# Altium project PROC154E3_SCH.PrjPcb (part 57 of 60)

## Sheet 61. SERDES CLOCK GENERATORS.SchDoc: SERDES CLOCK GENERATORS
size 513 x 386 mm; Project: PROC154E2(001)_SK_AM69; Issue: 1.0; RevCode: E3; Page Create Date: March  8, 1995; Variant Name: Core Design; Schematic Page Number: 61; Page Number: 61; Page Size: C; Comment: MISTRAL_TITLEBLK_CSIZE_1; Page Count: 62; Schematic Page Count: 62; Name: PROC154E2 001 SK AM69; DsnPath: C:\Users\danie\Downloads\sprr466c\PROC154E3_RP\PROC154E3_SCH.DSN; SchematicName: SCHEMATIC1; PageName: 61. SERDES CLOCK GENERATORS; PageSize: C; TopSchematic: True
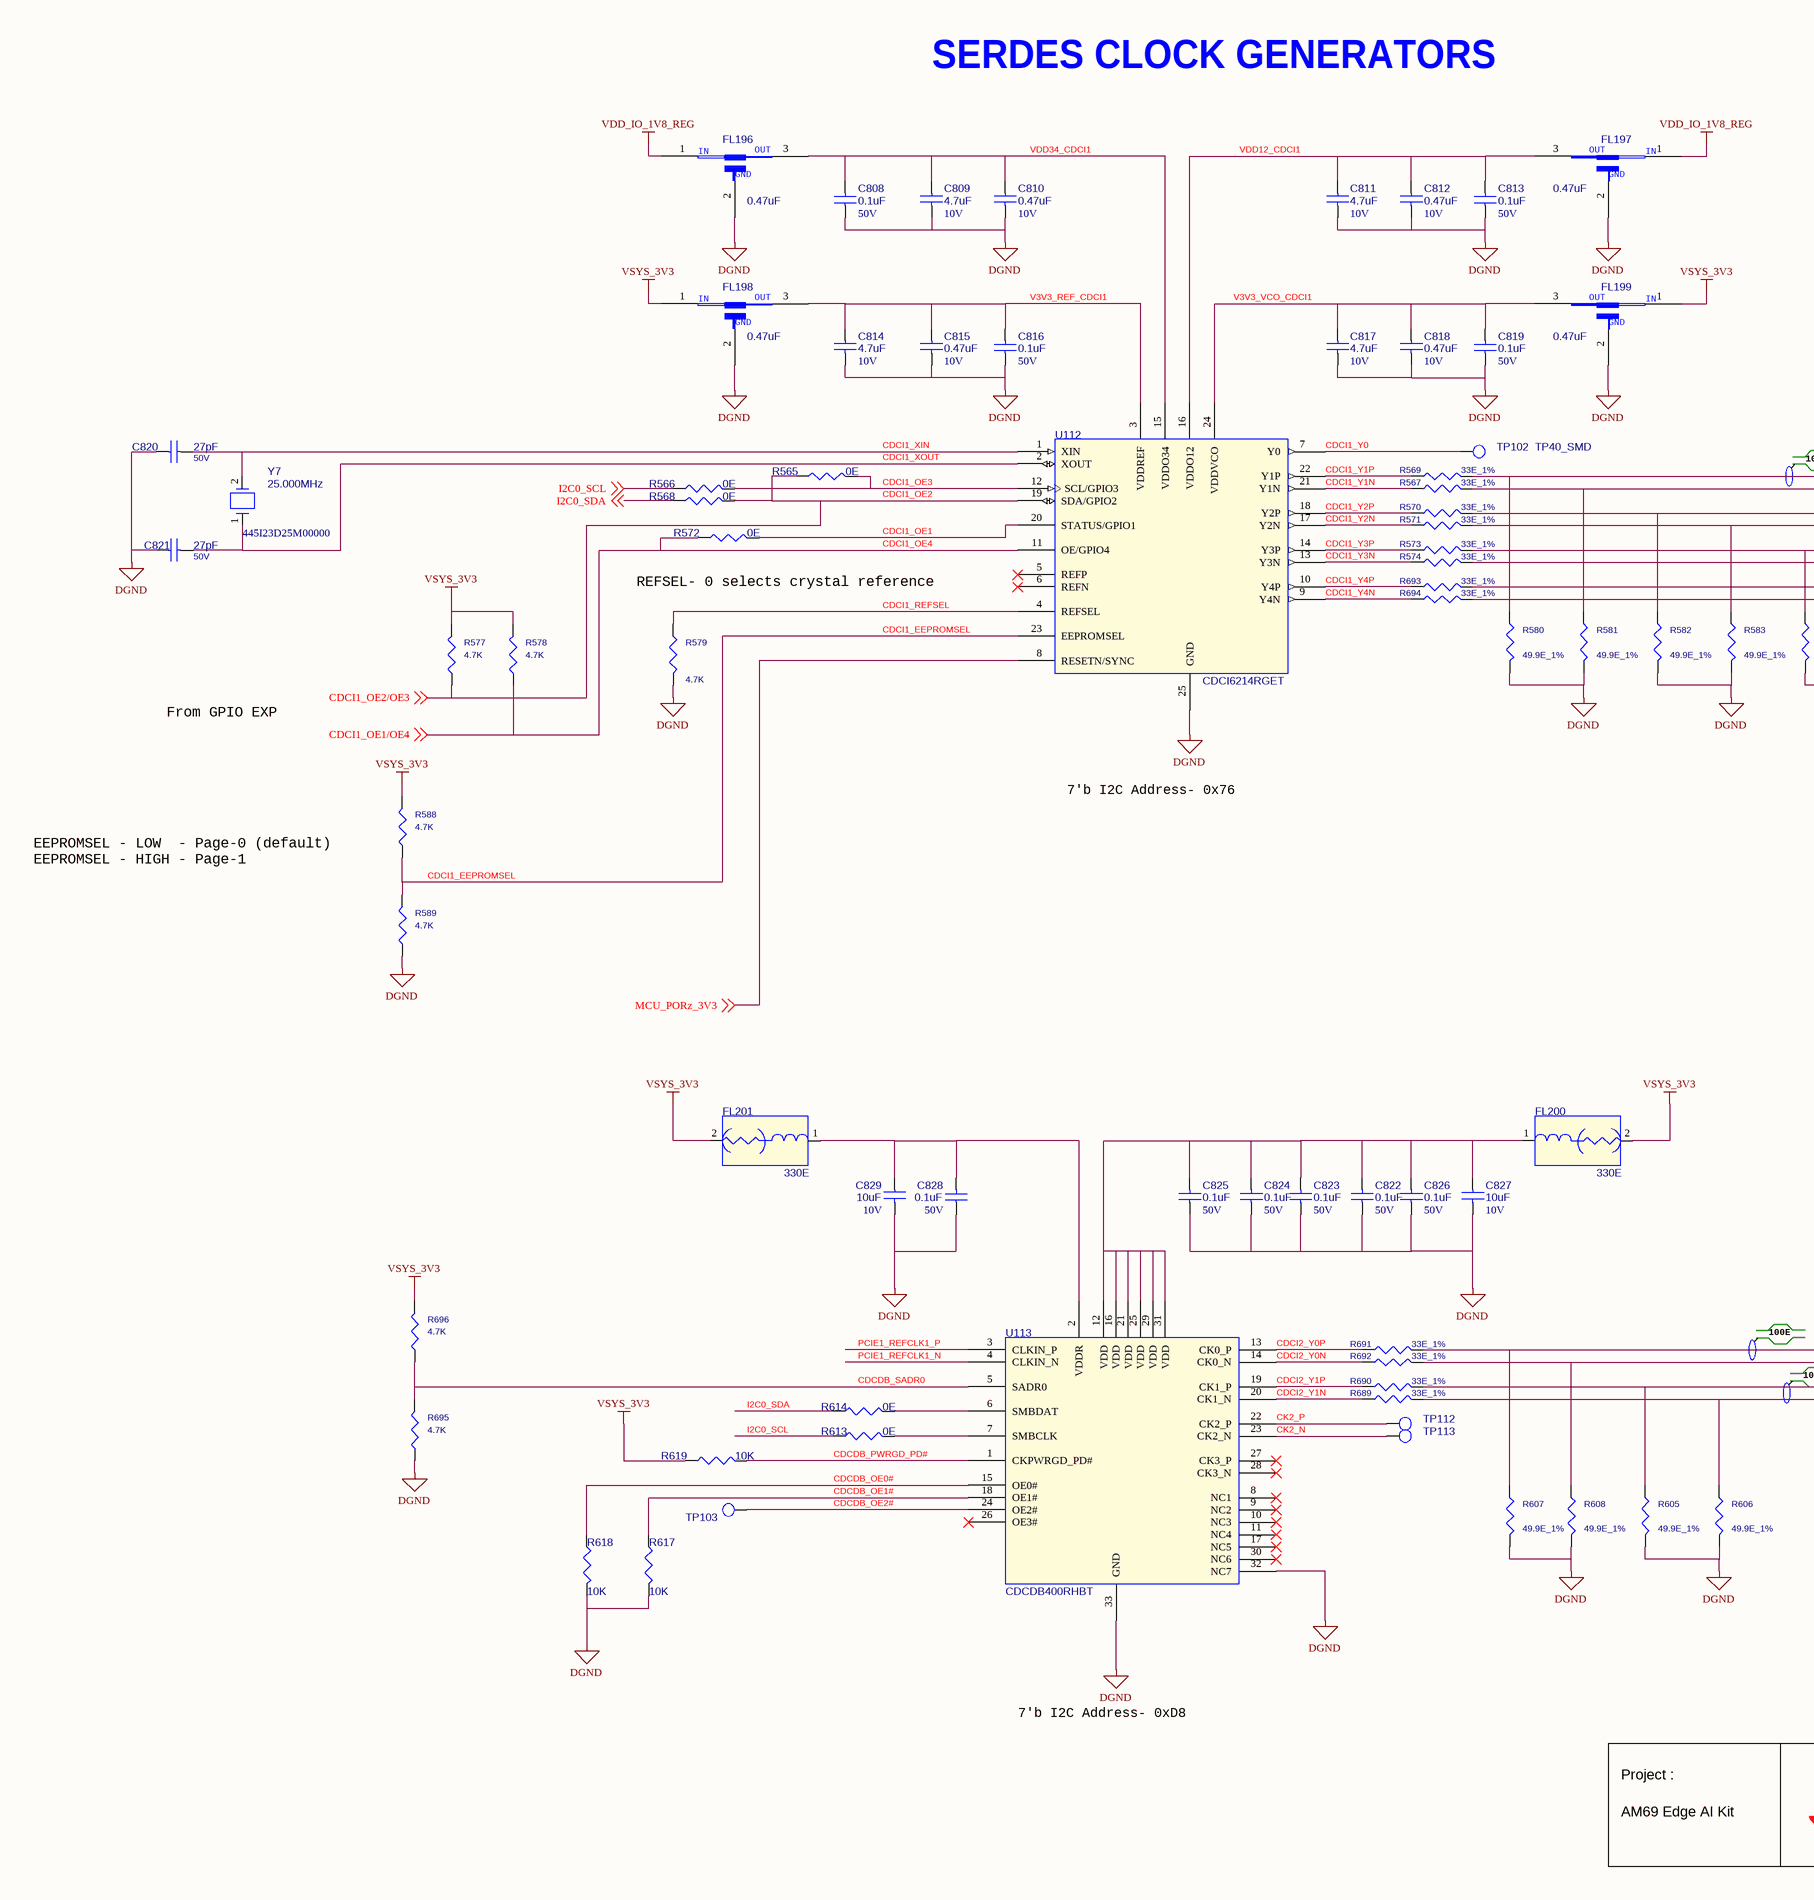
[diagram p102: 61. SERDES CLOCK GENERATORS.SchDoc, left]
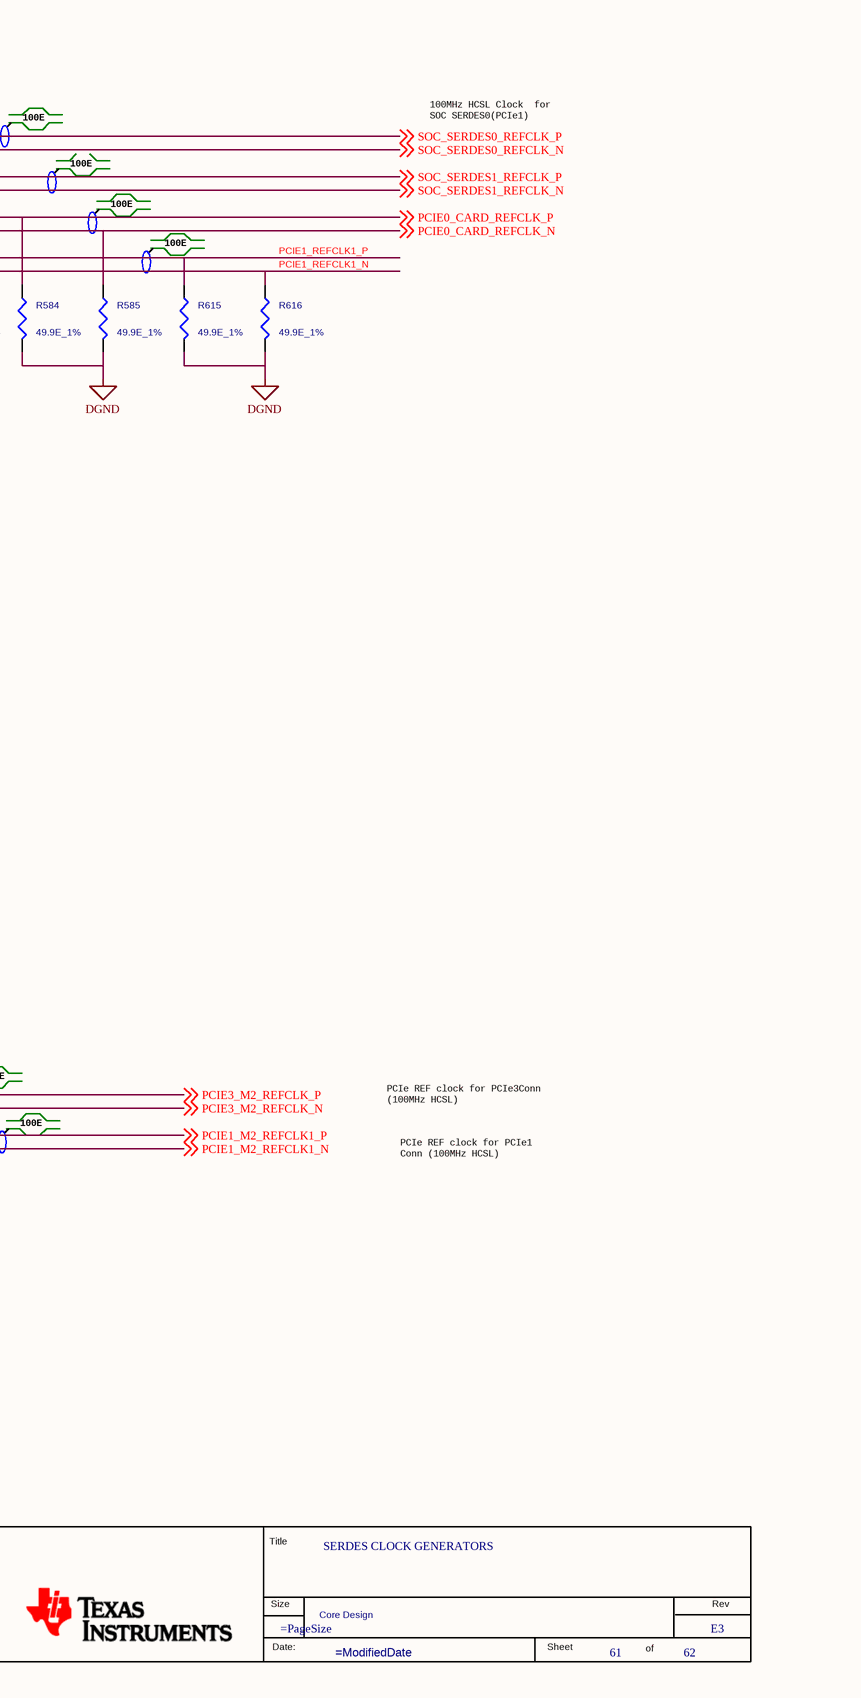
[diagram p103: 61. SERDES CLOCK GENERATORS.SchDoc, right]

### Parts
(Parts that share a designator on the sheet are numbered #1, #2 ... from top to bottom, then left to right.)
*#61  RevCode: E3  Title: SERDES CLOCK GENERATORS  Page Number: 61  Page Count: 62  Variant Name: Core Design  (hidden comment: MISTRAL_TITLEBLK_CSIZE_1)  (graphical)
C808  0.1uF  Voltage: 50V  [CAP0402_0-75]
C809  4.7uF  Voltage: 10V  [CAP0402_0-75]
C810  0.47uF  Voltage: 10V  [CAP0402_0-75]
C811  4.7uF  Voltage: 10V  [CAP0402_0-75]
C812  0.47uF  Voltage: 10V  [CAP0402_0-75]
C813  0.1uF  Voltage: 50V  [CAP0402_0-75]
C814  4.7uF  Voltage: 10V  [CAP0402_0-75]
C815  0.47uF  Voltage: 10V  [CAP0402_0-75]
C816  0.1uF  Voltage: 50V  [CAP0402_0-75]
C817  4.7uF  Voltage: 10V  [CAP0402_0-75]
C818  0.47uF  Voltage: 10V  [CAP0402_0-75]
C819  0.1uF  Voltage: 50V  [CAP0402_0-75]
C820  27pF  Voltage: 50V  [CAP0402_0-75]
C821  27pF  Voltage: 50V  [CAP0402_0-75]
C822  0.1uF  Voltage: 50V  [CAP0402_0-75]
C823  0.1uF  Voltage: 50V  [CAP0402_0-75]
C824  0.1uF  Voltage: 50V  [CAP0402_0-75]
C825  0.1uF  Voltage: 50V  [CAP0402_0-75]
C826  0.1uF  Voltage: 50V  [CAP0402_0-75]
C827  10uF  Voltage: 10V  [CAP0402_1]
C828  0.1uF  Voltage: 50V  [CAP0402_0-75]
C829  10uF  Voltage: 10V  [CAP0402_1]
FL196  0.47uF  [EMIFIL_NFM21P_0805]
FL197  0.47uF  [EMIFIL_NFM21P_0805]
FL198  0.47uF  [EMIFIL_NFM21P_0805]
FL199  0.47uF  [EMIFIL_NFM21P_0805]
FL200  330E  [EMIFIL_BLM18K_0603]
FL201  330E  [EMIFIL_BLM18K_0603]
R565  0E  [RES0402_0-5]
R566  0E  [RES0402_0-5]
R567  33E_1%  [RES0402_0-5]
R568  0E  [RES0402_0-5]
R569  33E_1%  [RES0402_0-5]
R570  33E_1%  [RES0402_0-5]
R571  33E_1%  [RES0402_0-5]
R572  0E  [RES0402_0-5]
R573  33E_1%  [RES0402_0-5]
R574  33E_1%  [RES0402_0-5]
R577  4.7K  [RES0402_0-5]
R578  4.7K  [RES0402_0-5]
R579  4.7K  [RES0402_0-5]
R580  49.9E_1%  [RES0402_0-5]
R581  49.9E_1%  [RES0402_0-5]
R582  49.9E_1%  [RES0402_0-5]
R583  49.9E_1%  [RES0402_0-5]
R584  49.9E_1%  [RES0402_0-5]
R585  49.9E_1%  [RES0402_0-5]
R588  4.7K  [RES0402_0-5]
R589  4.7K  [RES0402_0-5]
R605  49.9E_1%  [RES0402_0-5]
R606  49.9E_1%  [RES0402_0-5]
R607  49.9E_1%  [RES0402_0-5]
R608  49.9E_1%  [RES0402_0-5]
R613  0E  [RES0402_0-5]
R614  0E  [RES0402_0-5]
R615  49.9E_1%  [RES0402_0-5]
R616  49.9E_1%  [RES0402_0-5]
R617  10K  [RES0402_0-5]
R618  10K  [RES0402_0-5]
R619  10K  [RES0402_0-5]
R689  33E_1%  [RES0402_0-5]
R690  33E_1%  [RES0402_0-5]
R691  33E_1%  [RES0402_0-5]
R692  33E_1%  [RES0402_0-5]
R693  33E_1%  [RES0402_0-5]
R694  33E_1%  [RES0402_0-5]
R695  4.7K  [RES0402_0-5]
R696  4.7K  [RES0402_0-5]
TP102  TP40_SMD  [TP40_SMD]
TP103  TP40_SMD  [TP40_SMD]  (value not drawn)
TP112  TP40_SMD  [TP40_SMD]  (value not drawn)
TP113  TP40_SMD  [TP40_SMD]  (value not drawn)
U112  CDCI6214RGET  [QFN24_19-68_160X160_1]
U113  CDCDB400RHBT  [QFN32_19-68_200X200_1]
Y7  25.000MHz  Mfr_part_number: 445I23D25M00000  [XTAL_ABM3_205X130_SMD_1-4]

### Nets
DGND: C808.1 C809.2 C810.2 C811.2 C812.2 C813.1 C814.2 C815.2 C816.1 C817.2 C818.2 C819.1 C820.1 C821.1 C822.1 C823.1 C824.1 C825.1 C826.1 C827.2 C828.1 C829.2 FL196.2(GND1) FL197.2(GND1) FL198.2(GND1) FL199.2(GND1) R579.2 R580.2 R581.2 R582.2 R583.2 R584.2 R585.2 R589.2 R605.2 R606.2 R607.2 R608.2 R615.2 R616.2 R617.2 R618.2 R695.2 U112.25(GND) U113.32(NC7) U113.33(GND)  [project net VDD_CPU_HCPS_GOSNS]
VDD_IO_1V8_REG: FL196.1(IN) FL197.1(IN)
VSYS_3V3: FL198.1(IN) FL199.1(IN) FL200.2 FL201.2 R577.1 R578.1 R588.1 R619.1 R696.1  [project net V_3V3]
CDCDB_OE0#: R618.1 U113.15(OE0#)
CDCDB_OE1#: R617.1 U113.18(OE1#)
CDCDB_OE2#: TP103.1(TP) U113.24(OE2#)
CDCDB_PWRGD_PD#: R619.2 U113.1(CKPWRGD_PD#)
CDCDB_SADR0: R695.1 R696.2 U113.5(SADR0)
CDCI1_EEPROMSEL: R588.2 R589.1 U112.23(EEPROMSEL)
CDCI1_OE1: R572.2 U112.20(STATUS/GPIO1)
CDCI1_OE2: R565.1 R568.2 R577.2 U112.19(SDA/GPIO2) ; off-sheet CDCI1_OE2/OE3  [also labelled CDCI1_OE2/OE3]
CDCI1_OE3: R565.2 R566.2 U112.12(SCL/GPIO3)
CDCI1_OE4: R572.1 R578.2 U112.11(OE/GPIO4) ; off-sheet CDCI1_OE1/OE4  [also labelled CDCI1_OE1/OE4]
CDCI1_REFSEL: R579.1 U112.4(REFSEL)
CDCI1_XIN: C820.2 U112.1(XIN) Y7.2
CDCI1_XOUT: C821.2 U112.2(XOUT) Y7.1
CDCI1_Y0: TP102.1(TP) U112.7(Y0)
CDCI1_Y1N: R567.1 U112.21(Y1N)
CDCI1_Y1P: R569.1 U112.22(Y1P)
CDCI1_Y2N: R571.1 U112.17(Y2N)
CDCI1_Y2P: R570.1 U112.18(Y2P)
CDCI1_Y3N: R574.1 U112.13(Y3N)
CDCI1_Y3P: R573.1 U112.14(Y3P)
CDCI1_Y4N: R694.1 U112.9(Y4N)
CDCI1_Y4P: R693.1 U112.10(Y4P)
CDCI2_Y0N: R692.1 U113.14(CK0_N)
CDCI2_Y0P: R691.1 U113.13(CK0_P)
CDCI2_Y1N: R689.1 U113.20(CK1_N)
CDCI2_Y1P: R690.1 U113.19(CK1_P)
CK2_N: TP113.1(TP) U113.23(CK2_N)
CK2_P: TP112.1(TP) U113.22(CK2_P)
I2C0_SCL: R566.1 R613.1 ; off-sheet I2C0_SCL
I2C0_SDA: R568.1 R614.2 ; off-sheet I2C0_SDA
MCU_PORz_3V3: U112.8(RESETN/SYNC) ; off-sheet MCU_PORz_3V3
PCIE0_CARD_REFCLK_N: R574.2 R585.1 ; off-sheet PCIE0_CARD_REFCLK_N
PCIE0_CARD_REFCLK_P: R573.2 R584.1 ; off-sheet PCIE0_CARD_REFCLK_P
PCIE1_M2_REFCLK1_N: R606.1 R689.2 ; off-sheet PCIE1_M2_REFCLK1_N  [project net PCIE_REFCLK1_N_CONN]
PCIE1_M2_REFCLK1_P: R605.1 R690.2 ; off-sheet PCIE1_M2_REFCLK1_P  [project net PCIE_REFCLK1_P_CONN]
PCIE1_REFCLK1_N: R616.1 R694.2 U113.4(CLKIN_N)
PCIE1_REFCLK1_P: R615.1 R693.2 U113.3(CLKIN_P)
PCIE3_M2_REFCLK_N: R608.1 R692.2 ; off-sheet PCIE3_M2_REFCLK_N  [project net R_PCIE3_M2_REFCLK_N]
PCIE3_M2_REFCLK_P: R607.1 R691.2 ; off-sheet PCIE3_M2_REFCLK_P  [project net R_PCIE3_M2_REFCLK_P]
SOC_SERDES0_REFCLK_N: R567.2 R581.1 ; off-sheet SOC_SERDES0_REFCLK_N
SOC_SERDES0_REFCLK_P: R569.2 R580.1 ; off-sheet SOC_SERDES0_REFCLK_P
SOC_SERDES1_REFCLK_N: R571.2 R583.1 ; off-sheet SOC_SERDES1_REFCLK_N
SOC_SERDES1_REFCLK_P: R570.2 R582.1 ; off-sheet SOC_SERDES1_REFCLK_P
V3V3_REF_CDCI1: C814.1 C815.1 C816.2 FL198.3(OUT) U112.3(VDDREF)
V3V3_VCO_CDCI1: C817.1 C818.1 C819.2 FL199.3(OUT) U112.24(VDDVCO)
VDD12_CDCI1: C811.1 C812.1 C813.2 FL197.3(OUT) U112.16(VDDO12)
VDD34_CDCI1: C808.2 C809.1 C810.1 FL196.3(OUT) U112.15(VDDO34)
NetC822_2: C822.2 C823.2 C824.2 C825.2 C826.2 C827.1 FL200.1 U113.12(VDD) U113.16(VDD) U113.21(VDD) U113.25(VDD) U113.29(VDD) U113.31(VDD)
NetC828_2: C828.2 C829.1 FL201.1 U113.2(VDDR)
NetR613_2: R613.2 U113.7(SMBCLK)
NetR614_1: R614.1 U113.6(SMBDAT)

Not connected (* = marked no-connect by the designer): U112 5(REFP)* 6(REFN)*; U113 8(NC1)* 9(NC2)* 10(NC3)* 11(NC4)* 17(NC5)* 26(OE3#)* 27(CK3_P)* 28(CK3_N)* 30(NC6)*

### Notes on the sheet
- SERDES CLOCK GENERATORS
- 100E
- 100MHz HCSL Clock  for
  SOC SERDES0(PCIe1)
- REFSEL- 0 selects crystal reference
- (near R615) 100E
- From GPIO EXP
- 7'b I2C Address- 0x76
- (near R588) EEPROMSEL - LOW  - Page-0 (default)
  EEPROMSEL - HIGH - Page-1
- PCIe REF clock for PCIe3Conn
  (100MHz HCSL)
- PCIe REF clock for PCIe1
  Conn (100MHz HCSL)
- 7'b I2C Address- 0xD8
- (in symbol CAP_FILTER) GND
- (in symbol MISTRAL_TITLEBLK_CSIZE_1) Title; Project :; Size; Rev; AM69 Edge AI Kit; Date:; Sheet; of